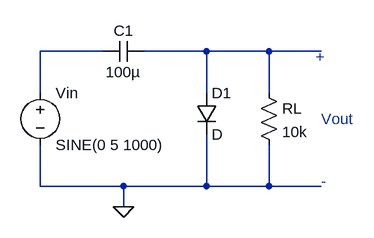
[diagram p0: schematic ClamperCircuit.asc]
ClamperCircuit.asc, the LTspice schematic file:
Version 4
SHEET 1 880 680
WIRE 288 208 192 208
WIRE 448 208 352 208
WIRE 544 208 448 208
WIRE 624 208 544 208
WIRE 192 272 192 208
WIRE 448 272 448 208
WIRE 544 272 544 208
WIRE 192 416 192 352
WIRE 320 416 192 416
WIRE 448 416 448 336
WIRE 448 416 320 416
WIRE 544 416 544 352
WIRE 544 416 448 416
WIRE 624 416 544 416
WIRE 320 448 320 416
FLAG 320 448 0
SYMBOL voltage 192 256 R0
SYMATTR InstName Vin
SYMATTR Value SINE(0 5 1000)
SYMBOL cap 352 192 R90
WINDOW 0 0 32 VBottom 2
WINDOW 3 32 32 VTop 2
SYMATTR InstName C1
SYMATTR Value 100µ
SYMBOL diode 432 272 R0
SYMATTR InstName D1
SYMBOL res 528 256 R0
SYMATTR InstName RL
SYMATTR Value 10k
TEXT 616 216 Left 2 ;+
TEXT 624 408 Left 2 ;-
TEXT 624 312 Left 2 ;Vout

The netlist it stands for:
* ClamperCircuit.asc
Vin N001 0 SINE(0 5 1000)
C1 N002 N001 100µ
D1 N002 0 D
RL N002 0 10k
.model D D
.lib standard.dio
* +
* -
* Vout
.backanno
.end